# Altium schematic sheet MCU.SchDoc
size A4
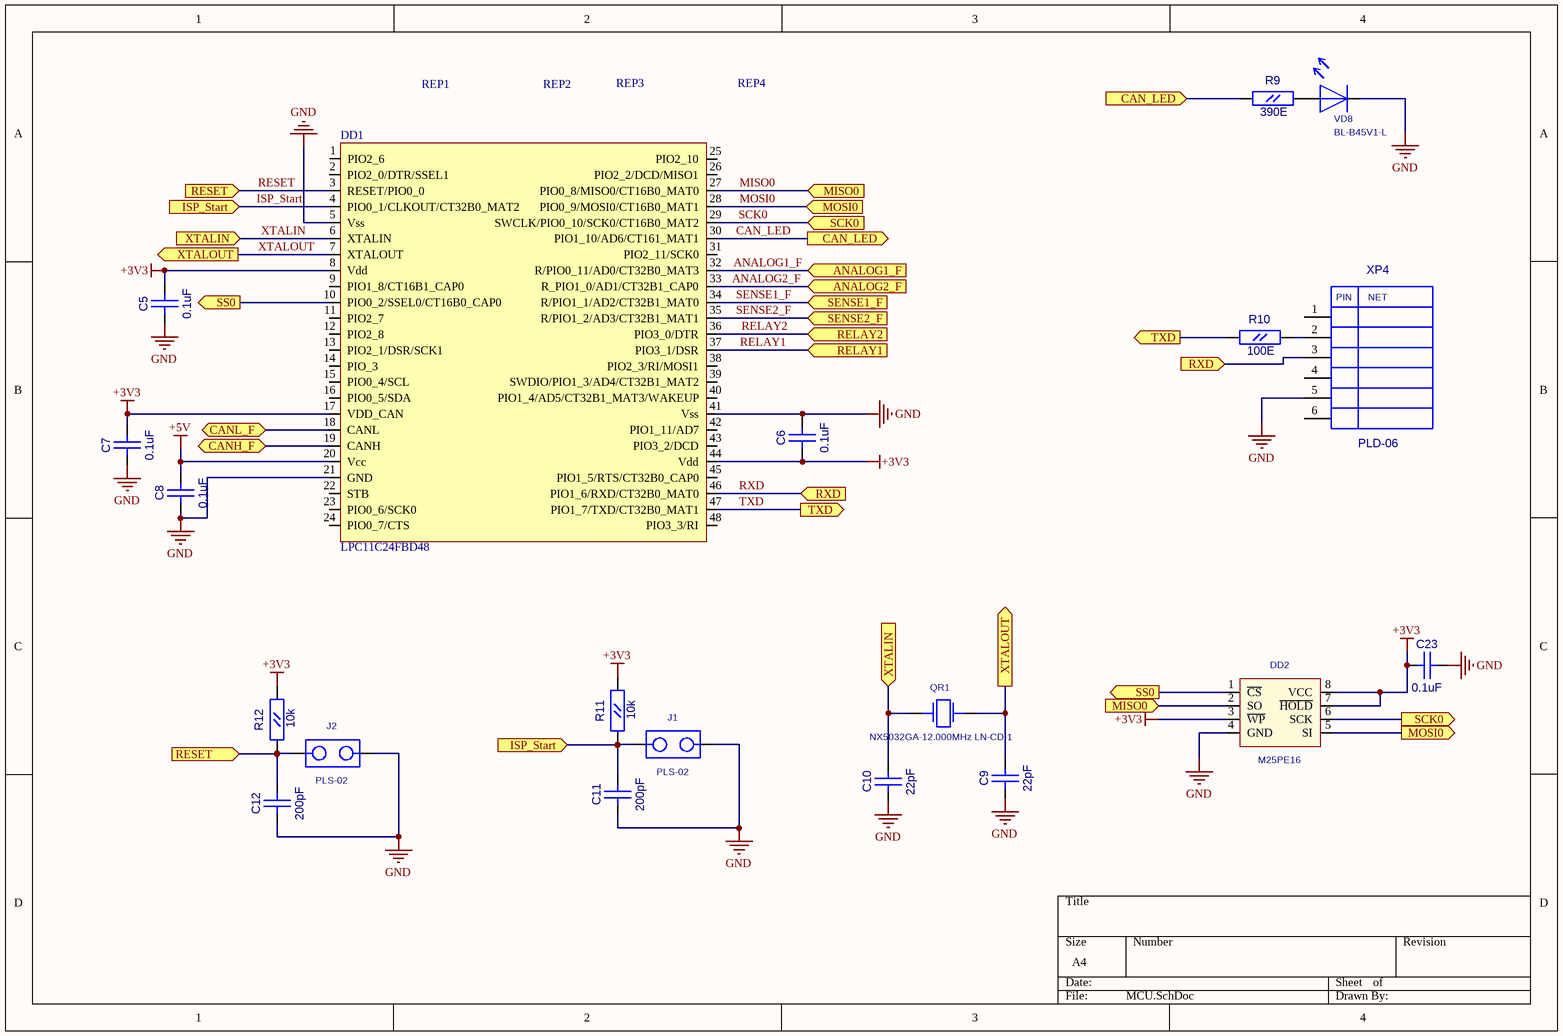
[diagram p0: MCU.SchDoc]

## Parts
C5  0.1uF  [CC0603]
C6  0.1uF  [CC0603]
C7  0.1uF  [CC0603]
C8  0.1uF  [CC0603]
C9  22pF  [CC0603]
C10  22pF  [CC0603]
C11  200pF  [CC0603]
C12  200pF  [CC0603]
C23  0.1uF  [CC0603]
DD1  LPC11C24FBD48  [LQFP-48]
DD2  M25PE16  [EIAJ_SO8]
J1  PLS-02  [PLS-02]
J2  PLS-02  [PLS-02]
QR1  NX5032GA-12.000MHz LN-CD-1  [AC5032_2]
R9  390E  [RC0603]
R10  100E  [RC0603]
R11  10k  [RC0603]
R12  10k  [RC0603]
REP1  REPER_POINT_1.2  [REPER1.2]  (value not drawn)
REP2  REPER_POINT_1.2  [REPER1.2]  (value not drawn)
REP3  REPER_POINT_1.2  [REPER1.2]  (value not drawn)
REP4  REPER_POINT_1.2  [REPER1.2]  (value not drawn)
VD8  BL-B45V1-L  [LED3]
XP4  PLD-06  [PIN6]

## Ports
ANALOG1_F (in), ANALOG2_F (in), CAN_LED (in), CAN_LED (out), CANH_F, CANL_F, ISP_Start (in), MISO0 (in), MOSI0 (in), MOSI0 (out), RELAY1 (in), RELAY2 (in), RESET (in), RXD (in), SCK0 (in), SCK0 (out), SENSE1_F (in), SENSE2_F (in), SS0 (out), TXD (out), XTALIN (in), XTALOUT (out)

## Nets
+3V3: C5.2(B) C6.1(A) C7.2(B) C23.1(A) DD1.8(Vdd) DD1.17(VDD_CAN) DD1.44(Vdd) DD2.3(~{WP}) DD2.7(~{HOLD}) DD2.8(VCC) R11.2(B) R12.2(B)
+5V: C8.2(B) DD1.20(Vcc)
GND: C5.1(A) C6.2(B) C7.1(A) C8.1(A) C9.1(A) C10.1(A) C11.1(A) C12.1(A) C23.2(B) DD1.5(Vss) DD1.21(GND) DD1.41(Vss) DD2.4(GND) J1.2 J2.2 VD8.1 XP4.5
ANALOG1_F: DD1.32(R/PIO0_11/AD0/CT32B0_MAT3) ; port ANALOG1_F
ANALOG2_F: DD1.33(R_PIO1_0/AD1/CT32B1_CAP0) ; port ANALOG2_F
CAN_LED: DD1.30(PIO1_10/AD6/CT161_MAT1) R9.1(A) ; port CAN_LED
CANH_F: DD1.19(CANH) ; port CANH_F
CANL_F: DD1.18(CANL) ; port CANL_F
ISP_Start: C11.2(B) DD1.4(PIO0_1/CLKOUT/CT32B0_MAT2) J1.1 R11.1(A) ; port ISP_Start
MISO0: DD1.27(PIO0_8/MISO0/CT16B0_MAT0) DD2.2(SO) ; port MISO0
MOSI0: DD1.28(PIO0_9/MOSI0/CT16B0_MAT1) DD2.5(SI) ; port MOSI0
RELAY1: DD1.37(PIO3_1/DSR) ; port RELAY1
RELAY2: DD1.36(PIO3_0/DTR) ; port RELAY2
RESET: C12.2(B) DD1.3(RESET/PIO0_0) J2.1 R12.1(A) ; port RESET
RXD: DD1.46(PIO1_6/RXD/CT32B0_MAT0) XP4.3 ; port RXD
SCK0: DD1.29(SWCLK/PIO0_10/SCK0/CT16B0_MAT2) DD2.6(SCK) ; port SCK0
SENSE1_F: DD1.34(R/PIO1_1/AD2/CT32B1_MAT0) ; port SENSE1_F
SENSE2_F: DD1.35(R/PIO1_2/AD3/CT32B1_MAT1) ; port SENSE2_F
SS0: DD1.10(PIO0_2/SSEL0/CT16B0_CAP0) DD2.1(~{CS}) ; port SS0
TXD: DD1.47(PIO1_7/TXD/CT32B0_MAT1) R10.1(A) ; port TXD
XTALIN: C10.2(B) DD1.6(XTALIN) QR1.1 ; port XTALIN
XTALOUT: C9.2(B) DD1.7(XTALOUT) QR1.2 ; port XTALOUT
NetR9_2: R9.2(B) VD8.2
NetR10_2: R10.2(B) XP4.2

Not connected (* = marked no-connect by the designer): DD1 1(PIO2_6) 2(PIO2_0/DTR/SSEL1) 9(PIO1_8/CT16B1_CAP0) 11(PIO2_7) 12(PIO2_8) 13(PIO2_1/DSR/SCK1) 14(PIO_3) 15(PIO0_4/SCL) 16(PIO0_5/SDA) 22(STB) 23(PIO0_6/SCK0) 24(PIO0_7/CTS) 25(PIO2_10) 26(PIO2_2/DCD/MISO1) 31(PIO2_11/SCK0) 38(PIO2_3/RI/MOSI1) 39(SWDIO/PIO1_3/AD4/CT32B1_MAT2) 40(PIO1_4/AD5/CT32B1_MAT3/WAKEUP) 42(PIO1_11/AD7) 43(PIO3_2/DCD) 45(PIO1_5/RTS/CT32B0_CAP0) 48(PIO3_3/RI); REP1 1; REP2 1; REP3 1; REP4 1; XP4 1 4 6

## Notes on the sheet
- (in symbol PLD-06) PIN; NET

## Library data of the parts
C5-C12 C23 = CC0603
  C5-C8 C23: Value: 0.1uF
  C9 C10: Value: 22pF
  C11 C12: Value: 200pF
DD2 = S25FL016A0LMFI01: Value: M25PE16
QR1 = AC5032_2: AC5032/2; Value: NX5032GA-12.000MHz LN-CD-1
R9-R12 = RC0603
  R9: Value: 390E
  R10: Value: 100E
  R11 R12: Value: 10k
REP1-REP4 = REPER1.2: Value: REPER_POINT_1.2
VD8 = LED_3: Value: BL-B45V1-L
XP4 = PLD-06: PLD06; Value: *
DD1 = LPC11C24FBD48: Value: LPC11C24FBD48
J1 J2 = PLS-02: Value: *